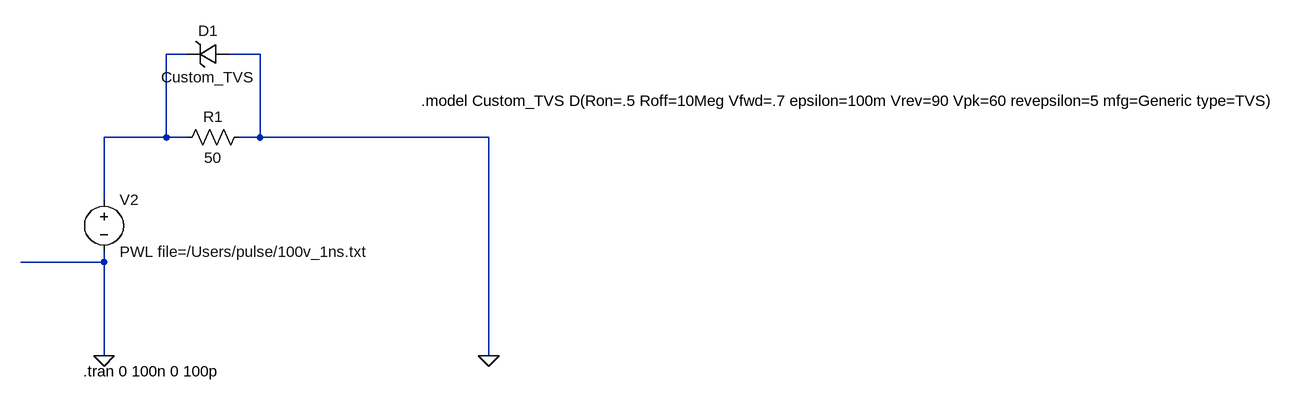
[diagram p0: schematic example2.asc]
example2.asc, the LTspice schematic file:
Version 4
SHEET 1 1784 680
WIRE 64 -352 32 -352
WIRE 176 -352 128 -352
WIRE 32 -224 32 -352
WIRE 32 -224 -64 -224
WIRE 64 -224 32 -224
WIRE 176 -224 176 -352
WIRE 176 -224 144 -224
WIRE 528 -224 176 -224
WIRE -64 -128 -64 -224
WIRE -64 -32 -64 -48
WIRE -64 -32 -192 -32
WIRE -64 112 -64 -32
WIRE 528 112 528 -224
FLAG -64 112 0
FLAG 528 112 0
SYMBOL voltage -64 -144 R0
WINDOW 123 0 0 Left 0
WINDOW 39 0 0 Left 0
SYMATTR InstName V2
SYMATTR Value PWL file=/Users/pulse/100v_1ns.txt
SYMBOL res 160 -240 R90
WINDOW 0 0 56 VBottom 2
WINDOW 3 32 56 VTop 2
SYMATTR InstName R1
SYMATTR Value 50
SYMBOL TVSdiode 128 -368 R90
WINDOW 0 -4 32 VBottom 2
WINDOW 3 36 32 VTop 2
SYMATTR InstName D1
SYMATTR Value Custom_TVS
TEXT -96 136 Left 2 !.tran 0 100n 0 100p
TEXT 424 -280 Left 2 !.model Custom_TVS D(Ron=.5 Roff=10Meg Vfwd=.7 epsilon=100m Vrev=90 Vpk=60 revepsilon=5 mfg=Generic type=TVS)

The netlist it stands for:
* example2.asc
V2 N001 0 PWL file=/Users/pulse/100v_1ns.txt
R1 0 N001 50
D1 0 N001 Custom_TVS
.model D D
.lib standard.dio
.tran 0 100n 0 100p
.model Custom_TVS D(Ron=.5 Roff=10Meg Vfwd=.7 epsilon=100m Vrev=90 Vpk=60 revepsilon=5 mfg=Generic type=TVS)
.backanno
.end